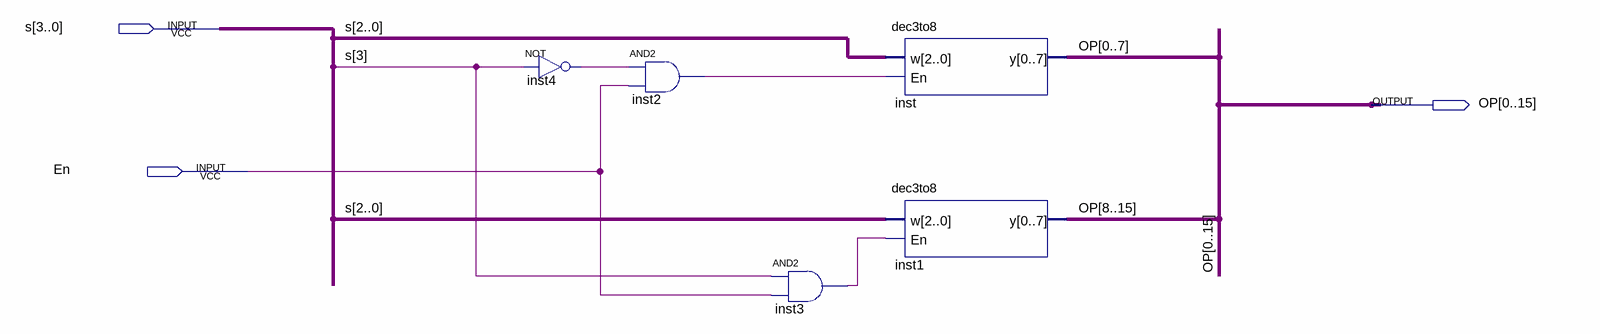
[diagram p0: schematic sheet]
// Quartus schematic modifieddec4to16.bdf as structural Verilog: 5 symbols, 3 pins
module modifieddec4to16 (
  input  [3:0] s,
  input  En,
  output [0:15] OP
);

  wire inst2_out, inst3_out, inst4_out;

  not inst4 (inst4_out, s[3]);
  and inst2 (inst2_out, inst4_out, En);
  and inst3 (inst3_out, s[3], En);
  dec3to8 inst (.w(s[2:0]), .En(inst2_out), .y(OP[0:7]));
  dec3to8 inst1 (.w(s[2:0]), .En(inst3_out), .y(OP[8:15]));
endmodule
